# EAGLE schematic DE0EC8 (EAGLE 5.10)
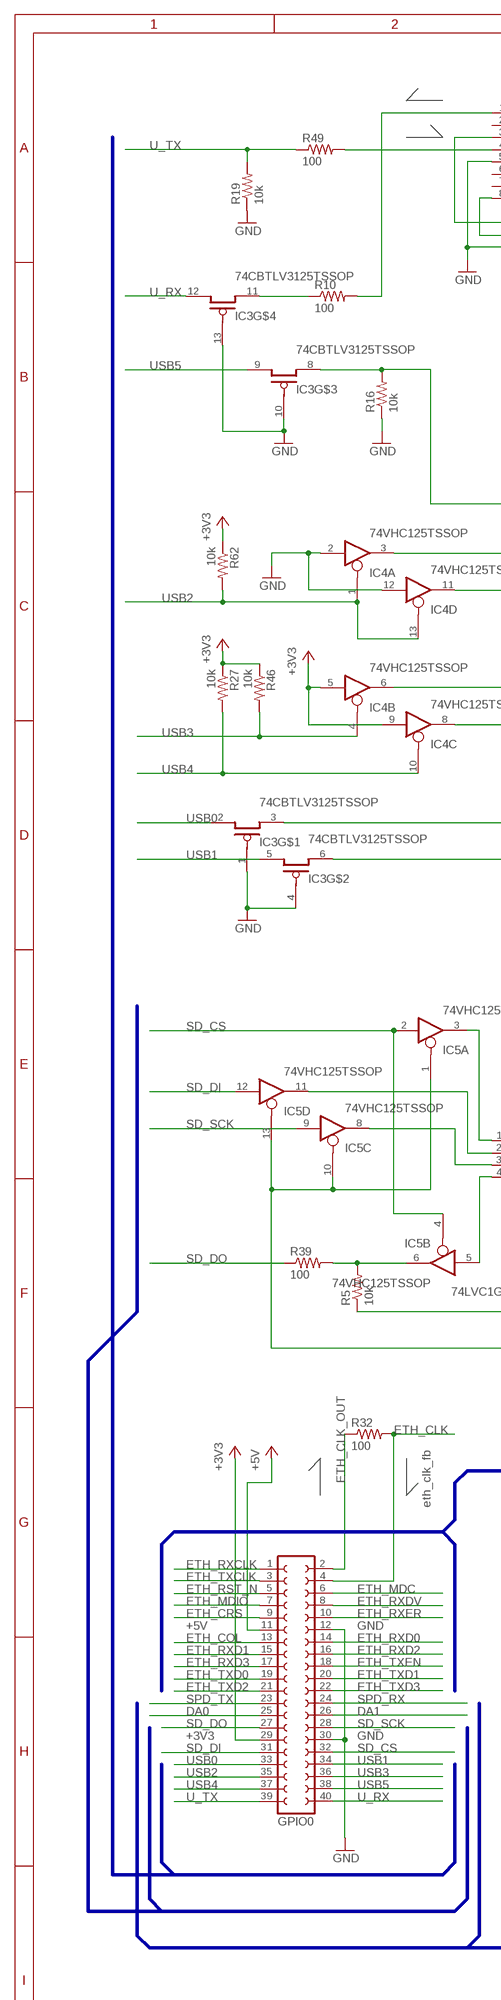
[diagram p0: schematic, sheet 1, part 1 of 2]
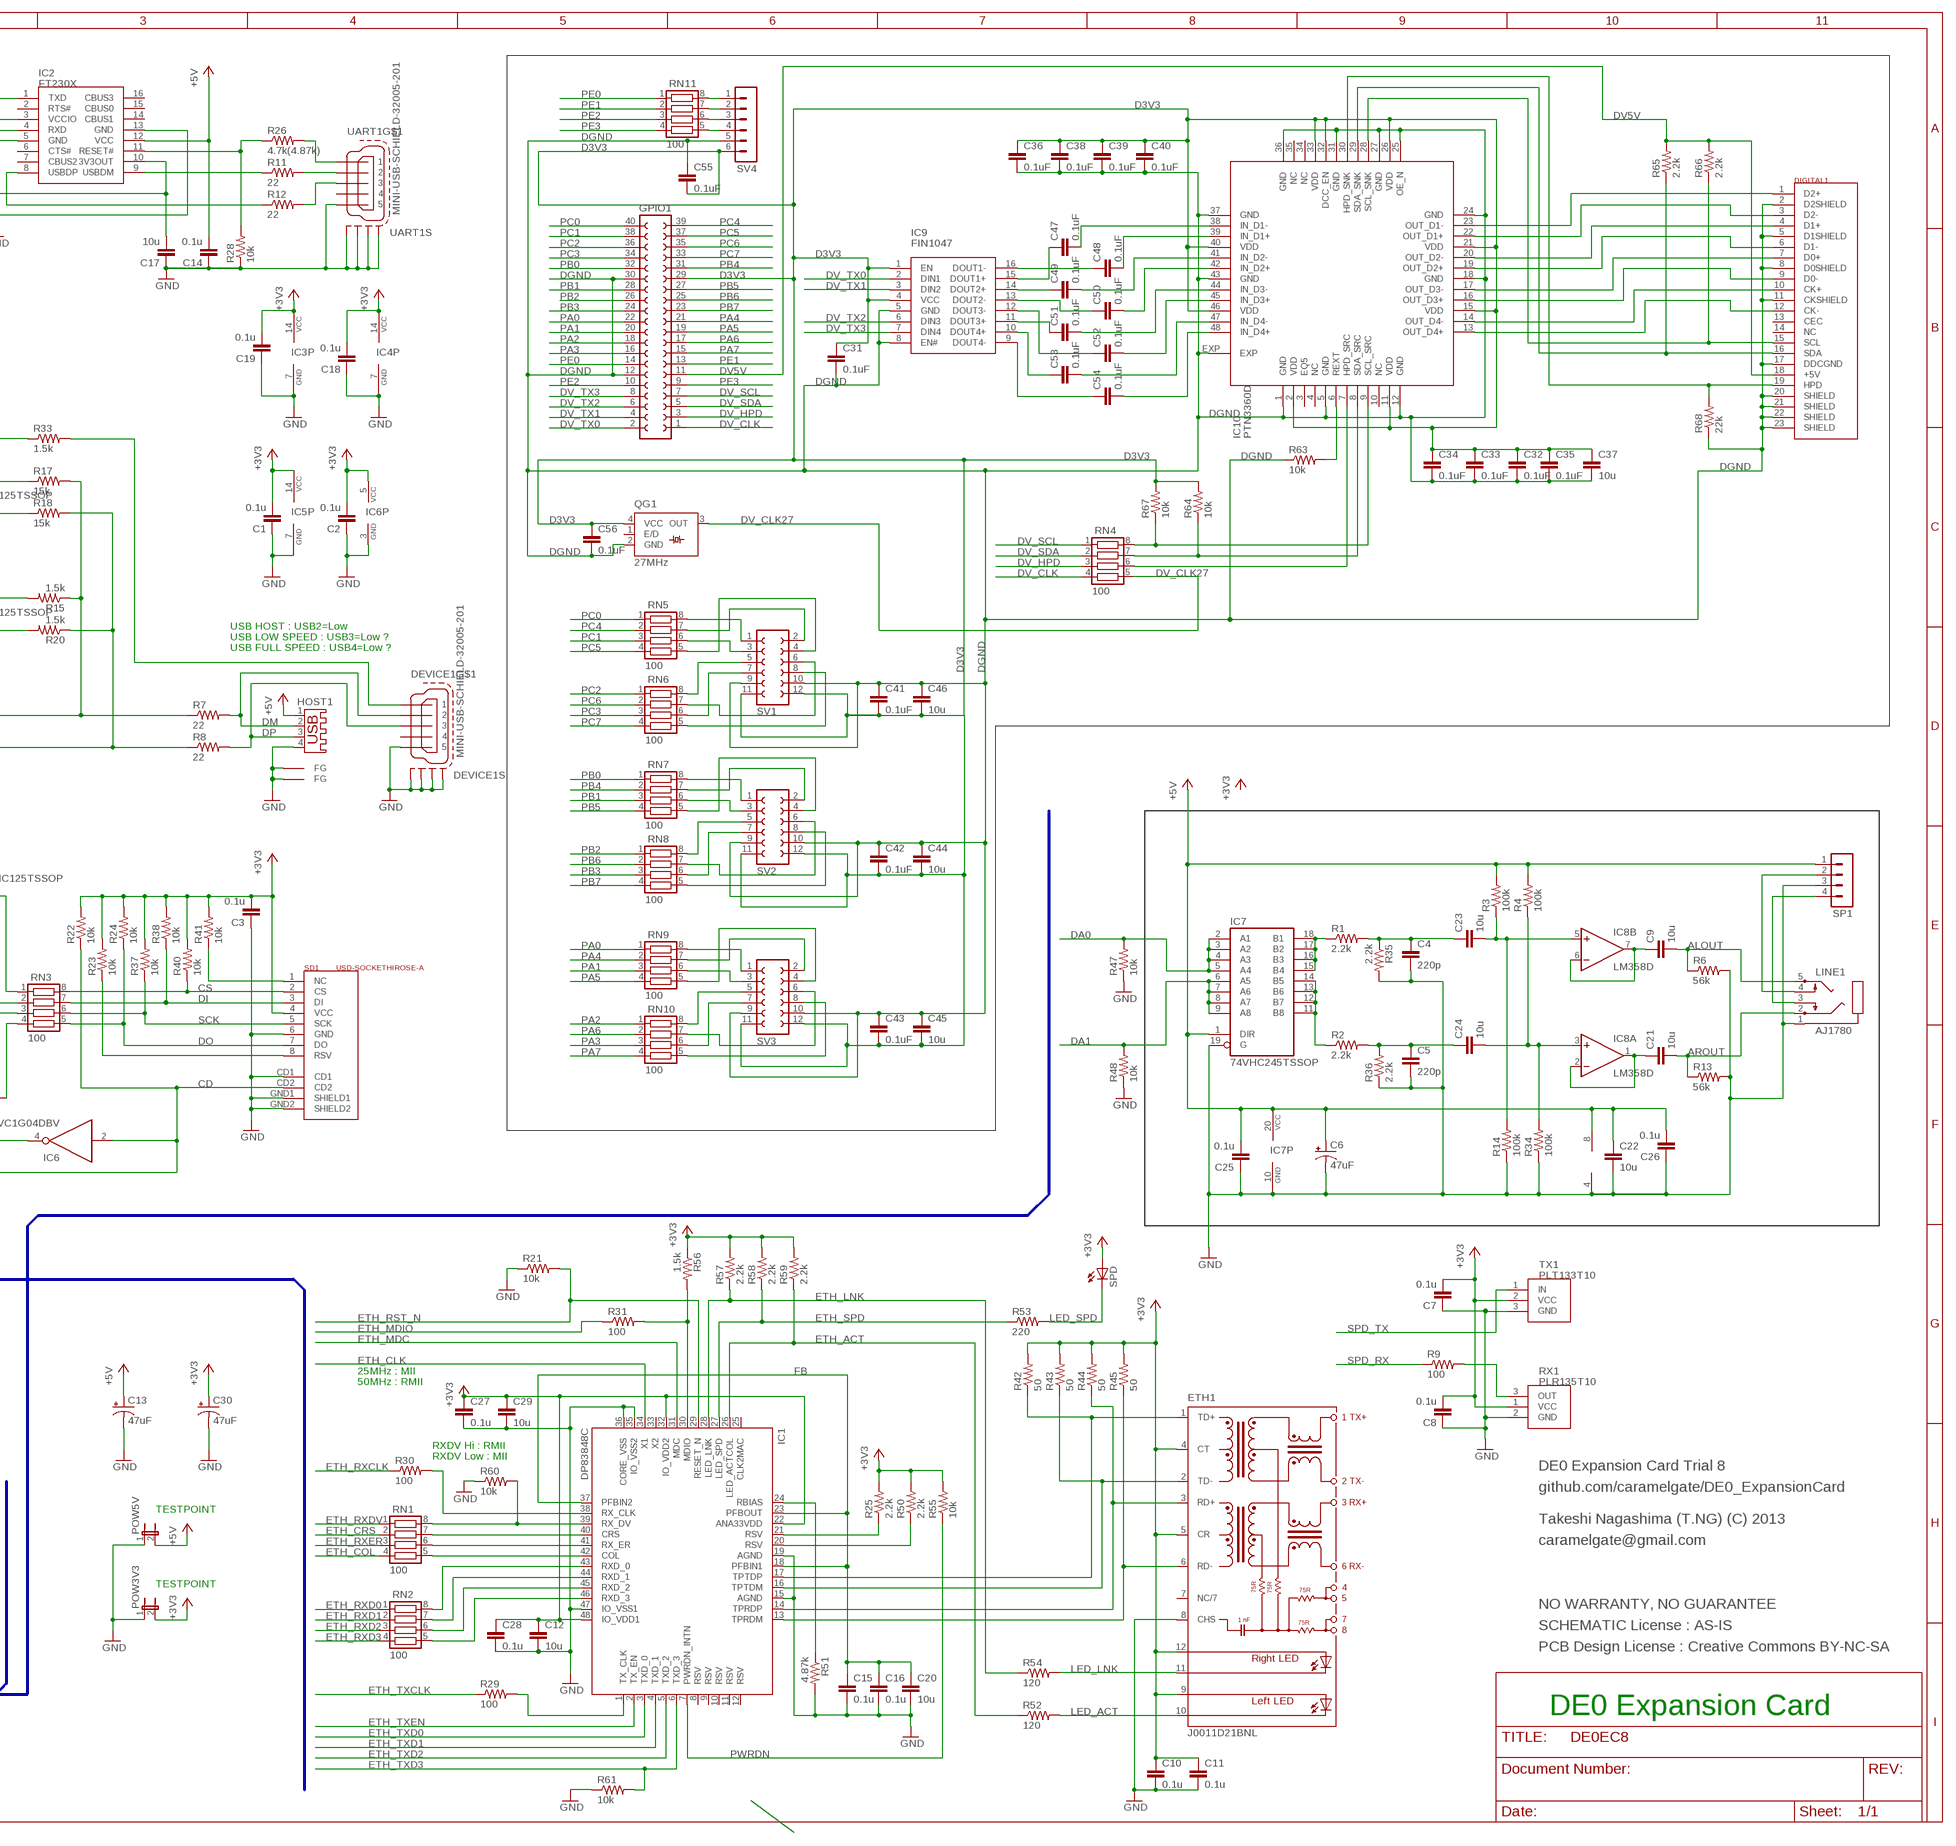
[diagram p1: schematic, sheet 1, part 2 of 2]

## Parts
C1  0.1u  C-EUC1608  [C1608]
C2  0.1u  C-EUC1608  [C1608]
C3  0.1u  C-EUC1608  [C1608]
C4  220p  C-EUC1608  [C1608]
C5  220p  C-EUC1608  [C1608]
C6  47uF  CPOL-USE2.5-7  [E2,5-7]
C7  0.1u  C-EUC1608  [C1608]
C8  0.1u  C-EUC1608  [C1608]
C9  10u  C-EUC2012  [C2012]
C10  0.1u  C-EUC1608  [C1608]
C11  0.1u  C-EUC1608  [C1608]
C12  10u  C-EUC2012  [C2012]
C13  47uF  CPOL-USE2.5-7  [E2,5-7]
C14  0.1u  C-EUC1608  [C1608]
C15  0.1u  C-EUC1608  [C1608]
C16  0.1u  C-EUC1608  [C1608]
C17  10u  C-EUC2012  [C2012]
C18  0.1u  C-EUC1608  [C1608]
C19  0.1u  C-EUC1608  [C1608]
C20  10u  C-EUC2012  [C2012]
C21  10u  C-EUC2012  [C2012]
C22  10u  C-EUC2012  [C2012]
C23  10u  C-EUC2012  [C2012]
C24  10u  C-EUC2012  [C2012]
C25  0.1u  C-EUC1608  [C1608]
C26  0.1u  C-EUC1608  [C1608]
C27  0.1u  C-EUC1608  [C1608]
C28  0.1u  C-EUC1608  [C1608]
C29  10u  C-EUC2012  [C2012]
C30  47uF  CPOL-USE2.5-7  [E2,5-7]
C31  0.1uF  C-EUC1608  [C1608]
C32  0.1uF  C-EUC1608  [C1608]
C33  0.1uF  C-EUC1608  [C1608]
C34  0.1uF  C-EUC1608  [C1608]
C35  0.1uF  C-EUC1608  [C1608]
C36  0.1uF  C-EUC1608  [C1608]
C37  10u  C-EUC2012  [C2012]
C38  0.1uF  C-EUC1608  [C1608]
C39  0.1uF  C-EUC1608  [C1608]
C40  0.1uF  C-EUC1608  [C1608]
C41  0.1uF  C-EUC1608  [C1608]
C42  0.1uF  C-EUC1608  [C1608]
C43  0.1uF  C-EUC1608  [C1608]
C44  10u  C-EUC2012  [C2012]
C45  10u  C-EUC2012  [C2012]
C46  10u  C-EUC2012  [C2012]
C47  0.1uF  C-EUC1608  [C1608]
C48  0.1uF  C-EUC1608  [C1608]
C49  0.1uF  C-EUC1608  [C1608]
C50  0.1uF  C-EUC1608  [C1608]
C51  0.1uF  C-EUC1608  [C1608]
C52  0.1uF  C-EUC1608  [C1608]
C53  0.1uF  C-EUC1608  [C1608]
C54  0.1uF  C-EUC1608  [C1608]
C55  0.1uF  C-EUC1608  [C1608]
C56  0.1uF  C-EUC1608  [C1608]
DEVICE1  MINI-USB-SCHIELD-32005-201  [32005-201]
DIGITAL1  HDMIHDMI-FCI-A  [HDMI-FCI-A-UPDATE]
ETH1  J0011D21BNL  [J0B]
GPIO0  FE20-2  [FE20-2]
GPIO1  FE20-2  [FE20-2]
HOST1  USB-A003A  [USB-A]
IC1  DP83848C  [LQFP48]
IC2  FT230X  [FT230X]
IC3  74CBTLV3125TSSOP  74CBT3125TSSOP  [PW_R-PDSO-G14]
IC4  74VHC125TSSOP  74125TSSOP  [PW_R-PDSO-G14]
IC5  74VHC125TSSOP  74125TSSOP  [PW_R-PDSO-G14]
IC6  74LVC1G04DBV  [SOT23-5]
IC7  74VHC245TSSOP  74245TSSOP  [PW_R-PDSO-G20]
IC8  LM358D  [SO08]
IC9  FIN1047  [PW_R-PDSO-G16]
IC10  PTN3360D  [QFN48-A]
LINE1  AJ1780  PG203JA  [PG203JA]
POW3V3  JP1EA  [JP1A]
POW5V  JP1EA  [JP1A]
QG1  27MHz  SM77H  [SM77H]
R1  2.2k  R-US_R0603  [R0603]
R2  2.2k  R-US_R0603  [R0603]
R3  100k  R-US_R0603  [R0603]
R4  100k  R-US_R0603  [R0603]
R5  10k  R-US_R0603  [R0603]
R6  56k  R-US_R0603  [R0603]
R7  22  R-US_R0603  [R0603]
R8  22  R-US_R0603  [R0603]
R9  100  R-US_R0603  [R0603]
R10  100  R-US_R0603  [R0603]
R11  22  R-US_R0603  [R0603]
R12  22  R-US_R0603  [R0603]
R13  56k  R-US_R0603  [R0603]
R14  100k  R-US_R0603  [R0603]
R15  1.5k  R-US_R0603  [R0603]
R16  10k  R-US_R0603  [R0603]
R17  15k  R-US_R0603  [R0603]
R18  15k  R-US_R0603  [R0603]
R19  10k  R-US_R0603  [R0603]
R20  1.5k  R-US_R0603  [R0603]
R21  10k  R-US_R0603  [R0603]
R22  10k  R-US_R0603  [R0603]
R23  10k  R-US_R0603  [R0603]
R24  10k  R-US_R0603  [R0603]
R25  2.2k  R-US_R0603  [R0603]
R26  4.7k(4.87k)  R-US_R0603  [R0603]
R27  10k  R-US_R0603  [R0603]
R28  10k  R-US_R0603  [R0603]
R29  100  R-US_R0603  [R0603]
R30  100  R-US_R0603  [R0603]
R31  100  R-US_R0603  [R0603]
R32  100  R-US_R0603  [R0603]
R33  1.5k  R-US_R0603  [R0603]
R34  100k  R-US_R0603  [R0603]
R35  2.2k  R-US_R0603  [R0603]
R36  2.2k  R-US_R0603  [R0603]
R37  10k  R-US_R0603  [R0603]
R38  10k  R-US_R0603  [R0603]
R39  100  R-US_R0603  [R0603]
R40  10k  R-US_R0603  [R0603]
R41  10k  R-US_R0603  [R0603]
R42  50  R-US_R0603  [R0603]
R43  50  R-US_R0603  [R0603]
R44  50  R-US_R0603  [R0603]
R45  50  R-US_R0603  [R0603]
R46  10k  R-US_R0603  [R0603]
R47  10k  R-US_R0603  [R0603]
R48  10k  R-US_R0603  [R0603]
R49  100  R-US_R0603  [R0603]
R50  2.2k  R-US_R0603  [R0603]
R51  4.87k  R-US_R0603  [R0603]
R52  120  R-US_R0603  [R0603]
R53  220  R-US_R0603  [R0603]
R54  120  R-US_R0603  [R0603]
R55  10k  R-US_R0603  [R0603]
R56  1.5k  R-US_R0603  [R0603]
R57  2.2k  R-US_R0603  [R0603]
R58  2.2k  R-US_R0603  [R0603]
R59  2.2k  R-US_R0603  [R0603]
R60  10k  R-US_R0603  [R0603]
R61  10k  R-US_R0603  [R0603]
R62  10k  R-US_R0603  [R0603]
R63  10k  R-US_R0603  [R0603]
R64  10k  R-US_R0603  [R0603]
R65  2.2k  R-US_R0603  [R0603]
R66  2.2k  R-US_R0603  [R0603]
R67  10k  R-US_R0603  [R0603]
R68  22k  R-US_R0603  [R0603]
RN1  100  CTS742C0832010  [EXB28V]
RN2  100  CTS742C0832010  [EXB28V]
RN3  100  CTS742C0832010  [EXB28V]
RN4  100  CTS742C0832010  [EXB28V]
RN5  100  CTS742C0832010  [EXB28V]
RN6  100  CTS742C0832010  [EXB28V]
RN7  100  CTS742C0832010  [EXB28V]
RN8  100  CTS742C0832010  [EXB28V]
RN9  100  CTS742C0832010  [EXB28V]
RN10  100  CTS742C0832010  [EXB28V]
RN11  100  CTS742C0832010  [EXB28V]
RX1  PLR135T10  [PL_13X/T10]
SD1  USD-SOCKETHIROSE-A  [DM3A-SF-PEJ-A]
SP1  MA04-1A  [MA04-1A]
SPD  LED3MM  [LED3MM]
SV1  FE06-2PMOD  [FE06-2P]
SV2  FE06-2PMOD  [FE06-2P]
SV3  FE06-2PMOD  [FE06-2P]
SV4  MA06-1A  [MA06-1A]
TX1  PLT133T10  [PL_13X/T10]
UART1  MINI-USB-SCHIELD-32005-201  [32005-201]

## Nets
+3V3: C1.2 C2.2 C3.2 C7.2 C8.2 C10.1 C11.1 C12.1 C18.2 C19.2 C27.1 C28.1 C29.1 C30.+ ETH1.4(CT) ETH1.5(CR) ETH1.9(A-L) ETH1.12(A-R) GPIO0.29 IC1.22(ANA33VDD) IC1.32(IO_VDD2) IC1.48(IO_VDD1) IC3.14(P:VCC) IC4.5(B:I) IC4.9(C:I) IC4.14(P:VCC) IC5.14(P:VCC) IC6.5(VCC) POW3V3.2 R22.2 R23.2 R24.2 R25.2 R27.1 R37.2 R38.2 R40.2 R41.2 R42.2 R43.2 R44.2 R45.2 R46.1 R50.2 R55.2 R56.1 R57.2 R58.2 R59.2 R62.1 RX1.1(VCC) SD1.4(VCC) SPD.A TX1.2(VCC)
+5V: C6.+ C13.+ C14.2 C22.1 C25.2 C26.2 GPIO0.11 HOST1.1 IC2.12(VCC) IC7.1(DIR) IC7.20(VCC) IC8.8(P:V+) POW5V.2 R3.2 R4.2 SP1.1
ALOUT: C9.2 LINE1.5 R6.1
AROUT: C21.2 LINE1.2 R13.1
CD: IC5.1(A:OE) IC5.10(C:OE) IC5.13(D:OE) IC6.2(I) R22.1 SD1.CD2
CS: R40.1 RN3.8 SD1.2(CS)
D3V3: C31.1 C32.1 C33.1 C34.1 C35.1 C36.1 C37.1 C38.1 C39.1 C40.1 C41.2 C42.2 C43.2 C44.2 C45.2 C46.2 C55.2 C56.1 GPIO1.29 IC9.1(EN) IC9.4(VCC) IC10.2(VDD) IC10.11(VDD) IC10.15(VDD) IC10.21(VDD) IC10.26(VDD) IC10.32(DCC_EN) IC10.33(VDD) IC10.40(VDD) IC10.46(VDD) QG1.4(VCC) R64.2 R67.2 SV1.11 SV1.12 SV2.11 SV2.12 SV3.11 SV3.12 SV4.6
DA0: GPIO0.25 IC7.2(A1) IC7.3(A2) IC7.4(A3) IC7.5(A4) R47.2
DA1: GPIO0.26 IC7.6(A5) IC7.7(A6) IC7.8(A7) IC7.9(A8) R48.2
DGND: C31.2 C32.2 C33.2 C34.2 C35.2 C36.2 C37.2 C38.2 C39.2 C40.2 C41.1 C42.1 C43.1 C44.1 C45.1 C46.1 C55.1 C56.2 DIGITAL1.2(D2SHIELD) DIGITAL1.5(D1SHIELD) DIGITAL1.8(D0SHIELD) DIGITAL1.11(CKSHIELD) DIGITAL1.17(DDCGND) DIGITAL1.20(SHIELD) DIGITAL1.21(SHIELD) DIGITAL1.22(SHIELD) DIGITAL1.23(SHIELD) GPIO1.12 GPIO1.30 IC9.5(GND) IC9.8(EN#) IC10.1(GND) IC10.5(GND) IC10.12(GND) IC10.18(GND) IC10.24(GND) IC10.25(OE_N) IC10.27(GND) IC10.31(GND) IC10.36(GND) IC10.37(GND) IC10.43(GND) IC10.EXP QG1.2(GND) R63.1 R68.1 SV1.9 SV1.10 SV2.9 SV2.10 SV3.9 SV3.10 SV4.5
DI: R38.1 RN3.7 SD1.3(DI)
DM: DEVICE1.2 HOST1.2 R7.2
DO: R24.1 RN3.5 SD1.7(DO)
DP: DEVICE1.3 HOST1.3 R8.2
DV5V: DIGITAL1.18(+5V) GPIO1.11 R65.2 R66.2
DV_CLK: GPIO1.1 RN4.4
DV_CLK27: QG1.3(OUT) RN4.5
DV_HPD: GPIO1.3 RN4.3
DV_SCL: GPIO1.7 RN4.1
DV_SDA: GPIO1.5 RN4.2
DV_TX0: GPIO1.2 IC9.2(DIN1)
DV_TX1: GPIO1.4 IC9.3(DIN2)
DV_TX2: GPIO1.6 IC9.6(DIN3)
DV_TX3: GPIO1.8 IC9.7(DIN4)
ETH_ACT: IC1.26(LED_ACTCOL) R52.1 R59.1
ETH_CLK: GPIO0.4 IC1.34(X1) R32.2
ETH_CLK_OUT: GPIO0.2 R32.1
ETH_COL: GPIO0.13 RN1.4
ETH_CRS: GPIO0.9 RN1.2
ETH_LNK: IC1.28(LED_LNK) R54.1 R57.1
ETH_MDC: GPIO0.6 IC1.31(MDC)
ETH_MDIO: GPIO0.7 R31.1
ETH_RST_N: GPIO0.5 IC1.29(RESET_N) R21.2
ETH_RXCLK: GPIO0.1 R30.1
ETH_RXD0: GPIO0.14 RN2.1
ETH_RXD1: GPIO0.15 RN2.2
ETH_RXD2: GPIO0.16 RN2.3
ETH_RXD3: GPIO0.17 RN2.4
ETH_RXDV: GPIO0.8 RN1.1
ETH_RXER: GPIO0.10 RN1.3
ETH_SPD: IC1.27(LED_SPD) R53.1 R58.1
ETH_TXCLK: GPIO0.3 R29.1
ETH_TXD0: GPIO0.19 IC1.3(TXD_0)
ETH_TXD1: GPIO0.20 IC1.4(TXD_1)
ETH_TXD2: GPIO0.21 IC1.5(TXD_2)
ETH_TXD3: GPIO0.22 IC1.6(TXD_3) R61.2
ETH_TXEN: GPIO0.18 IC1.2(TX_EN)
FB: C15.1 C16.1 C20.1 IC1.18(PFBIN1) IC1.23(PFBOUT) IC1.37(PFBIN2)
GND: C1.1 C2.1 C3.1 C4.2 C5.2 C6.- C7.1 C8.1 C10.2 C11.2 C12.2 C13.- C14.1 C15.2 C16.2 C17.1 C18.1 C19.1 C20.2 C22.2 C25.1 C26.1 C27.2 C28.2 C29.2 C30.- DEVICE1.5 DEVICE1.M1(S:S1) DEVICE1.M2(S:S2) DEVICE1.M3(S:S3) DEVICE1.M4(S:S4) ETH1.8(CHS) GPIO0.12 GPIO0.30 HOST1.4 HOST1.P$1(FG) HOST1.P$2(FG) IC1.15(AGND) IC1.19(AGND) IC1.35(IO_VSS2) IC1.36(CORE_VSS) IC1.47(IO_VSS1) IC2.5(GND) IC2.13(GND) IC3.1(OE) IC3.4(OE) IC3.7(P:GND) IC3.10(OE) IC3.13(OE) IC4.2(A:I) IC4.7(P:GND) IC4.12(D:I) IC5.7(P:GND) IC6.3(GND) IC7.10(GND) IC7.19(G) IC8.4(P:V-) LINE1.1 POW3V3.1 POW5V.1 R6.2 R13.2 R14.1 R16.1 R19.1 R21.1 R28.1 R34.1 R35.2 R36.1 R47.1 R48.1 R51.2 R60.1 R61.1 RX1.2(GND) SD1.6(GND) SD1.CD1 SD1.GND1(SHIELD1) SD1.GND2(SHIELD2) SP1.3 TX1.3(GND) UART1.5 UART1.M1(S:S1) UART1.M2(S:S2) UART1.M3(S:S3) UART1.M4(S:S4)
LED_ACT: ETH1.10(C-L) R52.2
LED_LNK: ETH1.11(C-R) R54.2
LED_SPD: R53.2 SPD.K(C)
N$1: C48.1 IC9.16(DOUT1-)
N$2: C47.2 IC10.38(IN_D1-)
N$3: C48.2 IC10.39(IN_D1+)
N$4: C49.2 IC10.41(IN_D2-)
N$5: LINE1.4 SP1.2
N$6: R12.2 UART1.3
N$7: IC2.8(USBDP) R12.1
N$8: DEVICE1.1 R33.2
N$9: LINE1.3 SP1.4
N$10: IC2.1(TXD) R10.2
N$11: C5.1 C24.1 R2.2 R36.2
N$12: C4.1 C23.1 R1.2 R35.1
N$13: IC7.15(B4) IC7.16(B3) IC7.17(B2) IC7.18(B1) R1.1
N$14: IC7.11(B8) IC7.12(B7) IC7.13(B6) IC7.14(B5) R2.1
N$15: C23.2 IC8.5(B:+IN) R3.1 R14.2
N$16: C24.2 IC8.3(A:+IN) R4.1 R34.2
N$17: IC6.4(O) R5.1
N$18: R9.2 RX1.3(OUT)
N$19: IC2.4(RXD) R49.2
N$20: IC3.8(O) R16.2 R33.1
N$21: C9.1 IC8.6(B:-IN) IC8.7(B:OUT)
N$22: R26.2 UART1.1
N$23: C21.1 IC8.1(A:OUT) IC8.2(A:-IN)
N$24: R11.2 UART1.2
N$25: C50.1 IC9.13(DOUT2-)
N$26: C51.1 IC9.11(DOUT3+)
N$27: C52.1 IC9.12(DOUT3-)
N$28: C53.1 IC9.10(DOUT4+)
N$29: IC4.6(B:O) R15.2
N$30: IC4.8(C:O) R20.2
N$31: IC2.11(RESET#) R26.1 R28.2
N$32: IC2.9(USBDM) R11.1
N$33: IC3.11(O) R10.1
N$34: IC5.3(A:O) RN3.1
N$35: IC1.38(RX_CLK) R30.2
N$36: C17.2 IC2.3(VCCIO) IC2.10(3V3OUT)
N$37: IC5.6(B:O) R5.2 R39.2
N$38: IC5.5(B:I) RN3.4
N$39: IC4.3(A:O) R17.1
N$40: IC3.3(O) R7.1 R15.1 R17.2
N$41: IC5.11(D:O) RN3.2
N$42: IC5.8(C:O) RN3.3
N$43: IC1.39(RX_DV) R60.2 RN1.8
N$45: IC4.11(D:O) R18.1
N$46: R41.1 SD1.1(NC)
N$47: R23.1 SD1.8(RSV)
N$48: IC1.40(CRS) RN1.7
N$51: C54.1 IC9.9(DOUT4-)
N$52: DIGITAL1.1(D2+) IC10.23(OUT_D1-)
N$53: IC1.41(RX_ER) RN1.6
N$55: IC1.42(COL) RN1.5
N$56: IC1.43(RXD_0) RN2.8
N$57: IC1.44(RXD_1) RN2.7
N$58: DIGITAL1.3(D2-) IC10.22(OUT_D1+)
N$59: IC1.45(RXD_2) RN2.6
N$60: IC1.46(RXD_3) RN2.5
N$61: IC1.1(TX_CLK) R29.2
N$62: DIGITAL1.4(D1+) IC10.20(OUT_D2-)
N$63: DIGITAL1.6(D1-) IC10.19(OUT_D2+)
N$64: IC1.30(MDIO) R31.2 R56.2
N$65: DIGITAL1.7(D0+) IC10.17(OUT_D3-)
N$66: DIGITAL1.9(D0-) IC10.16(OUT_D3+)
N$67: DIGITAL1.10(CK+) IC10.14(OUT_D4-)
N$68: IC3.6(O) R8.1 R18.2 R20.1
N$69: DIGITAL1.12(CK-) IC10.13(OUT_D4+)
N$70: DIGITAL1.19(HPD) IC10.30(HPD_SNK) R68.2
N$72: DIGITAL1.15(SCL) IC10.28(SCL_SNK) R66.1
N$73: IC10.6(REXT) R63.2
N$74: IC10.9(SCL_SRC) R67.1 RN4.8
N$75: IC10.8(SDA_SRC) R64.1 RN4.7
N$76: IC10.7(HPD_SRC) RN4.6
N$77: RN5.8 SV1.1
N$78: RN5.7 SV1.2
N$80: DIGITAL1.16(SDA) IC10.29(SDA_SNK) R65.1
N$81: RN5.6 SV1.3
N$82: RN5.5 SV1.4
N$83: RN6.8 SV1.5
N$84: RN6.7 SV1.6
N$85: RN6.6 SV1.7
N$86: RN6.5 SV1.8
N$87: RN7.8 SV2.1
N$88: RN7.7 SV2.2
N$89: RN7.6 SV2.3
N$90: RN7.5 SV2.4
N$91: RN8.8 SV2.5
N$92: RN8.7 SV2.6
N$93: RN8.6 SV2.7
N$94: RN8.5 SV2.8
N$95: RN9.8 SV3.1
N$96: RN9.7 SV3.2
N$97: RN9.6 SV3.3
N$98: RN9.5 SV3.4
N$99: RN10.8 SV3.5
N$100: RN10.7 SV3.6
N$101: RN10.6 SV3.7
N$102: RN10.5 SV3.8
N$104: RN11.8 SV4.1
N$105: C47.1 IC9.15(DOUT1+)
N$106: C49.1 IC9.14(DOUT2+)
N$107: C50.2 IC10.42(IN_D2+)
N$108: C51.2 IC10.44(IN_D3-)
N$109: C52.2 IC10.45(IN_D3+)
N$110: C53.2 IC10.47(IN_D4-)
N$111: C54.2 IC10.48(IN_D4+)
N$112: RN11.7 SV4.2
N$113: RN11.6 SV4.3
N$114: RN11.5 SV4.4
N$190: ETH1.1(TD+) IC1.17(TPTDP) R42.1
N$191: ETH1.2(TD-) IC1.16(TPTDM) R43.1
N$192: ETH1.3(RD+) IC1.14(TPRDP) R44.1
N$193: ETH1.6(RD-) IC1.13(TPRDM) R45.1
N$194: IC1.24(RBIAS) R51.1
N$195: IC1.21(RSV) R25.1
N$196: IC1.20(RSV) R50.1
PA0: GPIO1.22 RN9.1
PA1: GPIO1.20 RN9.3
PA2: GPIO1.18 RN10.1
PA3: GPIO1.16 RN10.3
PA4: GPIO1.21 RN9.2
PA5: GPIO1.19 RN9.4
PA6: GPIO1.17 RN10.2
PA7: GPIO1.15 RN10.4
PB0: GPIO1.32 RN7.1
PB1: GPIO1.28 RN7.3
PB2: GPIO1.26 RN8.1
PB3: GPIO1.24 RN8.3
PB4: GPIO1.31 RN7.2
PB5: GPIO1.27 RN7.4
PB6: GPIO1.25 RN8.2
PB7: GPIO1.23 RN8.4
PC0: GPIO1.40 RN5.1
PC1: GPIO1.38 RN5.3
PC2: GPIO1.36 RN6.1
PC3: GPIO1.34 RN6.3
PC4: GPIO1.39 RN5.2
PC5: GPIO1.37 RN5.4
PC6: GPIO1.35 RN6.2
PC7: GPIO1.33 RN6.4
PE0: GPIO1.14 RN11.1
PE1: GPIO1.13 RN11.2
PE2: GPIO1.10 RN11.3
PE3: GPIO1.9 RN11.4
PWRDN: IC1.7(PWRDN_INTN) R55.1
SCK: R37.1 RN3.6 SD1.5(SCK)
SD_CS: GPIO0.32 IC5.2(A:I) IC5.4(B:OE)
SD_DI: GPIO0.31 IC5.12(D:I)
SD_DO: GPIO0.27 R39.1
SD_SCK: GPIO0.28 IC5.9(C:I)
SPD_RX: GPIO0.24 R9.1
SPD_TX: GPIO0.23 TX1.1(IN)
U_RX: GPIO0.40 IC3.12(I)
U_TX: GPIO0.39 R19.2 R49.1
USB0: GPIO0.33 IC3.2(I)
USB1: GPIO0.34 IC3.5(I)
USB2: GPIO0.35 IC4.1(A:OE) IC4.13(D:OE) R62.2
USB3: GPIO0.36 IC4.4(B:OE) R46.2
USB4: GPIO0.37 IC4.10(C:OE) R27.2
USB5: GPIO0.38 IC3.9(I)
Unconnected: DEVICE1.4 DIGITAL1.13(CEC) DIGITAL1.14(NC) ETH1.7(NC/7) IC1.8(RSV) IC1.9(RSV) IC1.10(RSV) IC1.11(RSV) IC1.12(RSV) IC1.25(CLK2MAC) IC1.33(X2) IC2.2(RTS#) IC2.6(CTS#) IC2.7(CBUS2) IC2.14(CBUS1) IC2.15(CBUS0) IC2.16(CBUS3) IC10.3(EQ5) IC10.4(NC) IC10.10(NC) IC10.34(NC) IC10.35(NC) QG1.1(E/D) UART1.4

## Buses
B$1
B$5
B$8
B$9

## Notes on the sheet
- USB HOST : USB2=Low
- USB LOW SPEED : USB3=Low ?
- USB FULL SPEED : USB4=Low ?
- eth_clk_fb
- 25MHz : MII
- 50MHz : RMII
- RXDV Hi : RMII
- RXDV Low : MII
- DE0 Expansion Card Trial 8
- github.com/caramelgate/DE0_ExpansionCard
- TESTPOINT
- Takeshi Nagashima (T.NG) (C) 2013
- caramelgate@gmail.com
- TESTPOINT
- NO WARRANTY, NO GUARANTEE
- SCHEMATIC License : AS-IS
- PCB Design License : Creative Commons BY-NC-SA
- DE0 Expansion Card

## Library data of the parts
C1 C2 C4 C5 C7-C12 C14-C29 C31 C37 C44-C46 = rcl:C-EU: CAPACITOR, European symbol
C3 C32-C36 C38-C43 C47-C56 = add_lib:C-EU: CAPACITOR, European symbol
C6 C13 C30 = rcl:CPOL-US: POLARIZED CAPACITOR, American symbol
DEVICE1 UART1 = add_lib:MINI-USB-SCHIELD-: MINI USB-B Conector Source: www.cypressindustries.com
DIGITAL1 = adcr:HDMI
ETH1 = adcr:J0011D
GPIO0 GPIO1 = con-lsta:FE20-2: FEMALE HEADER
HOST1 = add_lib:USB-A003: USB connector
IC1 = adcr:DP83848C
IC2 = add_lib:FT230X
IC3 = add_lib:74CBT3125
IC4 IC5 = add_lib:74*125: Quad bus BUFFER, 3-state
IC6 = 74xx-little-us:74*1G04: INVERTER Gate
IC7 = add_lib:74*245: Octal BUS TRANSCEIVER, 3-state
IC8 = add_lib:LM358: OP AMP also LM158; LM258; LM2904 Source: http://cache.national.com/ds/LM/LM158.pdf
IC9 = add_lib:FIN1047
IC10 = add_lib:PTN3360D
LINE1 = add_lib:PG203J: MIC/HEADPHONE JACK KS-S stereo microphone/headphone jack PG203JN (Schukat)
POW3V3 POW5V = add_lib:JP1E: JUMPER
QG1 = add_lib:SM77H: 3.3V CMOS Clock Oscillator Source: www.pletronics.com .. sm77h%203.3v.pdf
R1-R17 R19-R62 = rcl:R-US_: RESISTOR, American symbol
R18 = add_lib:R-US_: RESISTOR, American symbol
R63-R68 = adcr:R-US_: RESISTOR, American symbol
RN1-RN11 = add_lib:CTS742C083: Chip Resistor Array 4 Single Resistor Source: http://www.ctscorp.com/components/Datasheets/CTSChipArrayDs.pdf
RX1 = add_lib:PLR135
SD1 = add_lib:USD-SOCKET: microSD Socket Push-push type uSD socket. Schematic element and footprint production proven. Spark Fun Electronics SKU : PRT-00127. tDoc lines correctly indicate media card edge positions when inserting (unlocked, locked, depressed).
SP1 = add_lib:MA04-1: PIN HEADER
SPD = add_lib:LED: LED OSRAM: - CHIPLED LG R971, LG N971, LY N971, LG Q971, LY Q971, LO R971, LY R971 LH N974, LH R974 LS Q976, LO Q976, LY Q976 LO Q996 - Hyper CHIPLED LW Q18S LB Q993, LB Q99A, LB R99A - SideLED LS A670, LO A670, LY A670, LG A670, LP A670 LB A673, LV A673, LT A673, LW A673 LH A674 LY A675 LS A676, LA A676, LO A676, LY A676, LW A676 LS A679, LY A679, LG A679 - Hyper Micro SIDELED® LS Y876, LA Y876, LO Y876, LY Y876 LT Y87S - SmartLED LW L88C, LW L88S LB L89C, LB L89S, LG L890 LS L89K, LO L89K, LY L89K LS L896, LA L896, LO L896, LY L896 - TOPLED LS T670, LO T670, LY T670, LG T670, LP T670 LSG T670, LSP T670, LSY T670, LOP T670, LYG T670 LG T671, LOG T671, LSG T671 LB T673, LV T673, LT T673, LW T673 LH T674 LS T676, LA T676, LO T676, LY T676, LB T676, LH T676, LSB T676, LW T676 LB T67C, LV T67C, LT T67C, LS T67K, LO T67K, LY T67K, LW E67C LS E67B, LA E67B, LO E67B, LY E67B, LB E67C, LV E67C, LT E67C LW T67C LS T679, LY T679, LG T679 LS T770, LO T770, LY T770, LG T770, LP T770 LB T773, LV T773, LT T773, LW T773 LH T774 LS E675, LA E675, LY E675, LS T675 LS T776, LA T776, LO T776, LY T776, LB T776 LHGB T686 LT T68C, LB T68C - Hyper Mini TOPLED® LB M676 - Mini TOPLED Santana® LG M470 LS M47K, LO M47K, LY M47K Source: http://www.osram.convergy.de LUXEON: - LUMILED® LXK2-PW12-R00, LXK2-PW12-S00, LXK2-PW14-U00, LXK2-PW14-V00 LXK2-PM12-R00, LXK2-PM12-S00, LXK2-PM14-U00 LXK2-PE12-Q00, LXK2-PE12-R00, LXK2-PE12-S00, LXK2-PE14-T00, LXK2-PE14-U00 LXK2-PB12-K00, LXK2-PB12-L00, LXK2-PB12-M00, LXK2-PB14-N00, LXK2-PB14-P00, LXK2-PB14-Q00 LXK2-PR12-L00, LXK2-PR12-M00, LXK2-PR14-Q00, LXK2-PR14-R00 LXK2-PD12-Q00, LXK2-PD12-R00, LXK2-PD12-S00 LXK2-PH12-R00, LXK2-PH12-S00 LXK2-PL12-P00, LXK2-PL12-Q00, LXK2-PL12-R00 Source: www.luxeon.com KINGBRIGHT: KA-3528ASYC Source: www.kingbright.com
SV1-SV3 = add_lib:FE06-2: FEMALE HEADER
SV4 = add_lib:MA06-1: PIN HEADER
TX1 = add_lib:PLT133